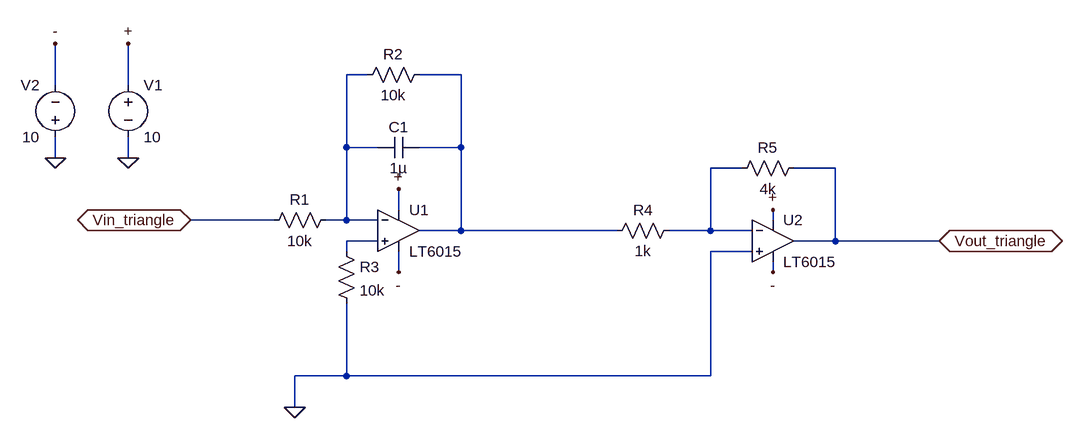
[diagram p0: schematic VCO_triangle.asc]
VCO_triangle.asc, the LTspice schematic file:
Version 4
SHEET 1 1224 680
WIRE 128 -128 96 -128
WIRE 272 -128 208 -128
WIRE -352 -112 -352 -176
WIRE -240 -112 -240 -176
WIRE 96 -16 96 -128
WIRE 144 -16 96 -16
WIRE 272 -16 272 -128
WIRE 272 -16 208 -16
WIRE -352 0 -352 -32
WIRE -240 0 -240 -32
WIRE 704 16 656 16
WIRE 848 16 784 16
WIRE 176 80 176 48
WIRE -16 96 -144 96
WIRE 96 96 96 -16
WIRE 96 96 64 96
WIRE 144 96 96 96
WIRE 752 96 752 80
WIRE 272 112 272 -16
WIRE 272 112 208 112
WIRE 512 112 272 112
WIRE 656 112 656 16
WIRE 656 112 592 112
WIRE 720 112 656 112
WIRE 144 128 96 128
WIRE 848 128 848 16
WIRE 848 128 784 128
WIRE 1008 128 848 128
WIRE 96 144 96 128
WIRE 720 144 656 144
WIRE 176 176 176 144
WIRE 752 176 752 160
WIRE 96 336 96 224
WIRE 96 336 16 336
WIRE 656 336 656 144
WIRE 656 336 96 336
WIRE 16 384 16 336
FLAG 176 48 +
FLAG 176 176 -
FLAG 16 384 0
FLAG -352 0 0
FLAG -240 0 0
FLAG -240 -176 +
FLAG -352 -176 -
FLAG 752 80 +
FLAG 752 176 -
FLAG -144 96 Vin_triangle
IOPIN -144 96 BiDir
FLAG 1008 128 Vout_triangle
IOPIN 1008 128 BiDir
SYMBOL Opamps\\LT6015 176 112 R0
SYMATTR InstName U1
SYMBOL res 80 80 R90
WINDOW 0 0 56 VBottom 2
WINDOW 3 32 56 VTop 2
SYMATTR InstName R1
SYMATTR Value 10k
SYMBOL cap 208 -32 R90
WINDOW 0 0 32 VBottom 2
WINDOW 3 32 32 VTop 2
SYMATTR InstName C1
SYMATTR Value 1µ
SYMBOL res 224 -144 R90
WINDOW 0 0 56 VBottom 2
WINDOW 3 32 56 VTop 2
SYMATTR InstName R2
SYMATTR Value 10k
SYMBOL res 80 128 R0
SYMATTR InstName R3
SYMATTR Value 10k
SYMBOL res 608 96 R90
WINDOW 0 0 56 VBottom 2
WINDOW 3 32 56 VTop 2
SYMATTR InstName R4
SYMATTR Value 1k
SYMBOL res 800 0 R90
WINDOW 0 0 56 VBottom 2
WINDOW 3 32 56 VTop 2
SYMATTR InstName R5
SYMATTR Value 4k
SYMBOL Opamps\\LT6015 752 128 R0
SYMATTR InstName U2
SYMBOL voltage -240 -128 R0
WINDOW 123 0 0 Left 0
WINDOW 39 0 0 Left 0
SYMATTR InstName V1
SYMATTR Value 10
SYMBOL voltage -352 -16 R180
WINDOW 0 24 96 Left 2
WINDOW 3 24 16 Left 2
WINDOW 123 0 0 Left 0
WINDOW 39 0 0 Left 0
SYMATTR InstName V2
SYMATTR Value 10

The netlist it stands for:
* VCO_triangle.asc
XU1 N004 N001 + - N002 LT6016  ; LT6015, pins In+ In- V+ V- OUT
R1 N001 Vin_triangle 10k
C1 N002 N001 1µ
R2 N002 N001 10k
R3 N004 0 10k
R4 N003 N002 1k
R5 Vout_triangle N003 4k
XU2 0 N003 + - Vout_triangle LT6016  ; LT6015, pins In+ In- V+ V- OUT
V1 + 0 10
V2 0 - 10
.lib LTC2.lib
.backanno
.end